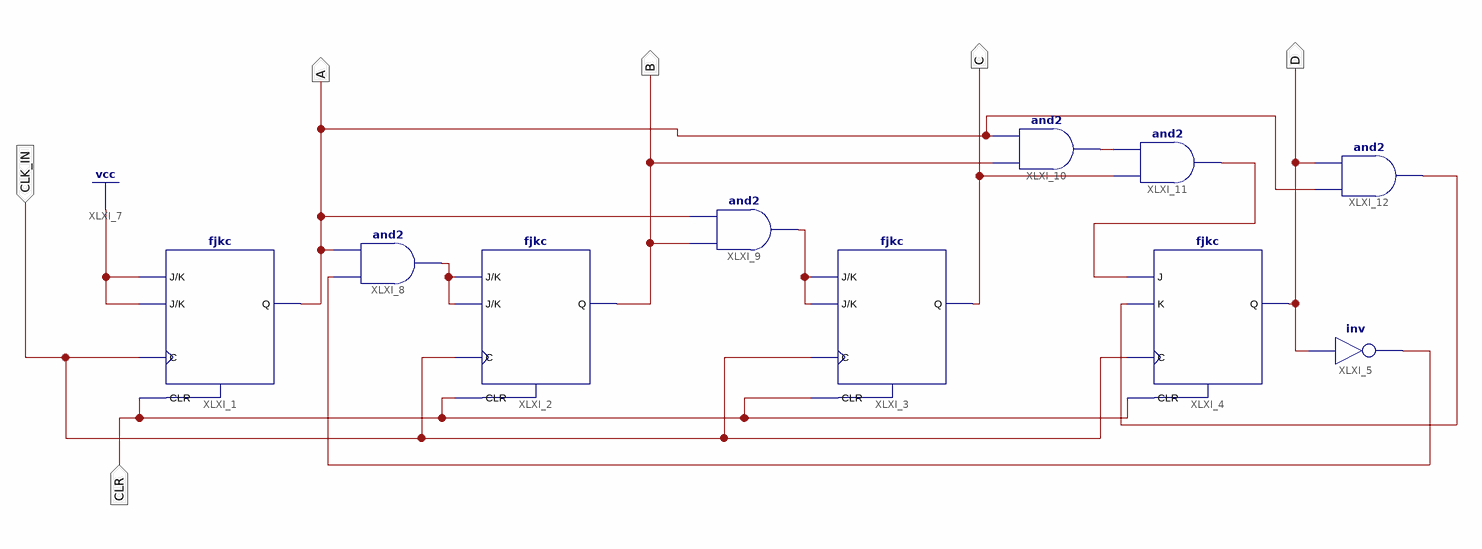
[diagram p0: schematic sheet 1]
// Xilinx ISE schematic jkCounter0to9.sch (spartan6) as structural Verilog: 10 symbols, 6 ports
module jkCounter0to9 (
  input  CLK_IN,
  input  CLR,
  output A,
  output B,
  output C,
  output D
);

  wire XLXN_15, XLXN_17, XLXN_47, XLXN_48, XLXN_50, XLXN_52;

  fjkc XLXI_1 (.C(CLK_IN), .CLR(CLR), .J(1'b1), .K(1'b1), .Q(A));
  fjkc XLXI_2 (.C(CLK_IN), .CLR(CLR), .J(XLXN_15), .K(XLXN_15), .Q(B));
  fjkc XLXI_3 (.C(CLK_IN), .CLR(CLR), .J(XLXN_47), .K(XLXN_47), .Q(C));
  and XLXI_8 (XLXN_15, XLXN_17, A);
  and XLXI_9 (XLXN_47, B, A);
  fjkc XLXI_4 (.C(CLK_IN), .CLR(CLR), .J(XLXN_50), .K(XLXN_52), .Q(D));
  not XLXI_5 (XLXN_17, D);
  and XLXI_10 (XLXN_48, B, A);
  and XLXI_11 (XLXN_50, C, XLXN_48);
  and XLXI_12 (XLXN_52, A, D);
endmodule
